# Altium schematic sheet Deel_5_display.SchDoc: Soldeerstation
size A4; DrawnBy: Kenneth Rennen; Revision: 1.0; SheetNumber: 5; SheetTotal: 5; Number: PXL_1EAI_12102667; Sheet of: 5/5
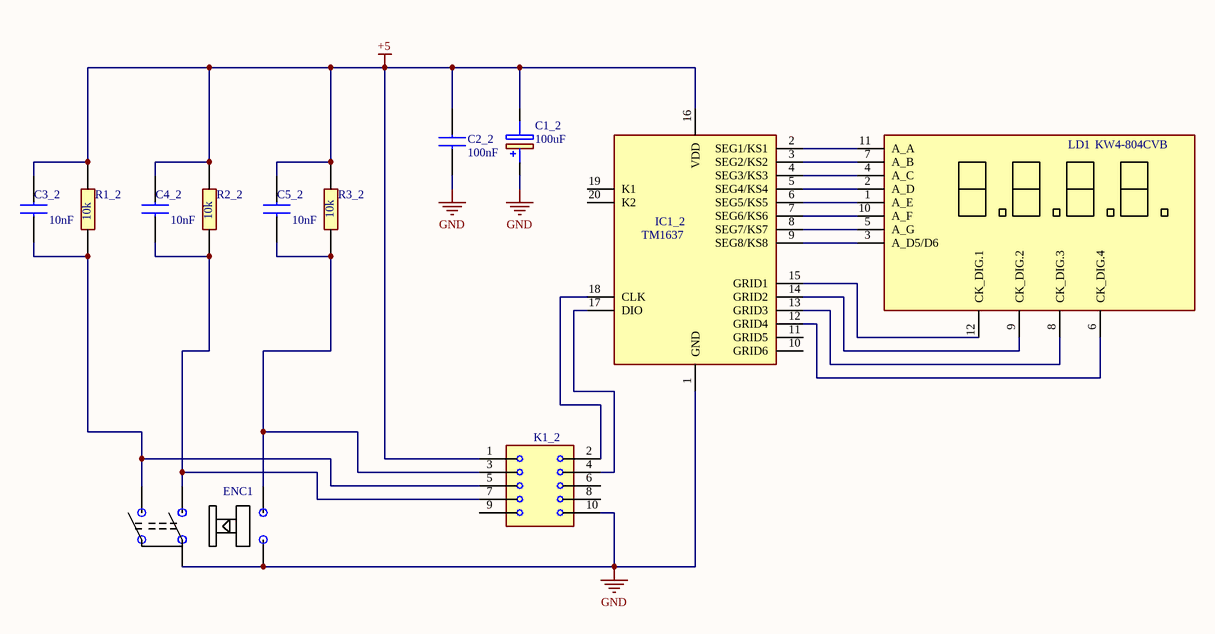
[diagram p0: Deel_5_display.SchDoc]

## Parts
C1_2  100uF  [100uf]
C2_2  100nF  [100nF]
C3_2  10nF  [10nF]
C4_2  10nF  [10nF]
C5_2  10nF  [10nF]
ENC1  PEC11R-4225F-S0024 encoder  [PEC11R-4225F-S0024]  (value not drawn)
IC1_2  TM1637  [tm1637]
K1_2  10 boxheader  [10BoxHeader]  (value not drawn)
LD1  KW4-804CVB  [kw4]
R1_2  10k  [10k]
R2_2  10k  [10k]
R3_2  10k  [10k]

## Nets
+5: C1_2.2(-) C2_2.2 C3_2.2 C4_2.2 C5_2.2 IC1_2.16(VDD) K1_2.1 R1_2.2 R2_2.2 R3_2.2
GND: C1_2.1(+) C2_2.1 ENC1.3 ENC1.4 IC1_2.1(GND) K1_2.10
NetC3_2_1: C3_2.1 ENC1.1 K1_2.5 R1_2.1
NetC4_2_1: C4_2.1 ENC1.2 K1_2.7 R2_2.1
NetC5_2_1: C5_2.1 ENC1.5 K1_2.3 R3_2.1
NetIC1_2_2: IC1_2.2(SEG1/KS1) LD1.11(A_A)
NetIC1_2_3: IC1_2.3(SEG2/KS2) LD1.7(A_B)
NetIC1_2_4: IC1_2.4(SEG3/KS3) LD1.4(A_C)
NetIC1_2_5: IC1_2.5(SEG4/KS4) LD1.2(A_D)
NetIC1_2_6: IC1_2.6(SEG5/KS5) LD1.1(A_E)
NetIC1_2_7: IC1_2.7(SEG6/KS6) LD1.10(A_F)
NetIC1_2_8: IC1_2.8(SEG7/KS7) LD1.5(A_G)
NetIC1_2_9: IC1_2.9(SEG8/KS8) LD1.3(A_D5/D6)
NetIC1_2_12: IC1_2.12(GRID4) LD1.6(CK_DIG.4)
NetIC1_2_13: IC1_2.13(GRID3) LD1.8(CK_DIG.3)
NetIC1_2_14: IC1_2.14(GRID2) LD1.9(CK_DIG.2)
NetIC1_2_15: IC1_2.15(GRID1) LD1.12(CK_DIG.1)
NetIC1_2_17: IC1_2.17(DIO) K1_2.4
NetIC1_2_18: IC1_2.18(CLK) K1_2.2

Not connected (* = marked no-connect by the designer): IC1_2 10(GRID6) 11(GRID5) 19(K1) 20(K2); K1_2 6 8 9

## Library data of the parts
C1_2 = 100uF: Capacitor Polarised RGA101M1HBK-0811G; Manufacturer_Name: Lelon; Datasheet Link: https://www.arrow.com/en/products/rga101m1hbk-0811g/lelon-electronics; Height: 13mm; Manufacturer_Part_Number: RGA101M1HBK-0811G
C2_2 = 100nF: Capacitor; Manufacturer_Name: AVX; Manufacturer_Part_Number: 0402YC104MAT2A; Datasheet Link: http://www.mouser.com/catalog/supplier/library/pdf/AVXSurfaceMountCeramic.pdf; Height: 0.56mm; Mouser Part Number: 581-0402YC104MAT2A; Mouser Price/Stock: https://www.mouser.co.uk/ProductDetail/AVX/0402YC104MAT2A?qs=O2%2FeDh0sX9yiCaLwpXy1bw%3D%3D
C3_2 C4_2 C5_2 = 10nF: Capacitor; Manufacturer_Name: AVX; Manufacturer_Part_Number: 0402YC104MAT2A; Datasheet Link: http://www.mouser.com/catalog/supplier/library/pdf/AVXSurfaceMountCeramic.pdf; Height: 0.56mm; Mouser Part Number: 581-0402YC104MAT2A; Mouser Price/Stock: https://www.mouser.co.uk/ProductDetail/AVX/0402YC104MAT2A?qs=O2%2FeDh0sX9yiCaLwpXy1bw%3D%3D
ENC1 = PEC11R-4225F-S0024 encoder: draai encoder met drukknop; Manufacturer_Name: Bourns; Datasheet Link: https://componentsearchengine.com/Datasheets/1/PEC11R-4225F-S0024.pdf; Manufacturer_Part_Number: PEC11R-4225F-S0024; Mouser Part Number: 652-PEC11R-4225F-S24; Mouser Price/Stock: https://www.mouser.co.uk/ProductDetail/Bourns/PEC11R-4225F-S0024?qs=Zq5ylnUbLm4N6UNkPX3pkQ%3D%3D; Arrow Part Number: PEC11R-4225F-S0024; Arrow Price/Stock: https://www.arrow.com/en/products/pec11r-4225f-s0024/bourns?region=nac
IC1_2 = TM1637__SOP_: Integrated Circuit; Manufacturer_Name: TITAN MICRO ELECTRONICS; Manufacturer_Part_Number: TM1637 (SOP); Datasheet Link: https://www.mcielectronics.cl/website_MCI/static/documents/Datasheet_TM1637.pdf; Height: 2.8mm
K1_2 = 10 boxheader: Connector; Manufacturer_Name: Molex; Manufacturer_Part_Number: 0010897100; Datasheet Link: http://www.molex.com/pdm_docs/sd/010897100_sd.pdf; Height: 8.64mm; Mouser Part Number: N/A; Mouser Price/Stock: https://www.mouser.co.uk/ProductDetail/Molex/0010897100?qs=PBcRNPEHKsqIDCZzUxhahw%3D%3D; Arrow Part Number: 0010897100; Arrow Price/Stock: https://www.arrow.com/en/products/0010897100/molex?region=nac
LD1 = KW4-804CVB: Display; Manufacturer_Name: Luckylight; Datasheet Link: https://www.tme.eu/Document/21b6c1f82a45ad996bb1bfe0c31af292/KW4-804XVB.pdf; Height: 7.75mm; Manufacturer_Part_Number: KW4-804CVB
R1_2 R2_2 R3_2 = 10k: Resistor; Manufacturer_Name: TE Connectivity; Manufacturer_Part_Number: CPF0805B100RE1; Datasheet Link: https://datasheet.datasheetarchive.com/originals/distributors/DKDS-21/401696.pdf; Height: 0.65mm; Mouser Part Number: 279-CPF0805B100RE1; Mouser Price/Stock: https://www.mouser.co.uk/ProductDetail/TE-Connectivity-Holsworthy/CPF0805B100RE1?qs=9ylKvqdyudkCWLPT1QvLZQ%3D%3D; Arrow Part Number: CPF0805B100RE1; Arrow Price/Stock: https://www.arrow.com/en/products/cpf0805b100re1/te-connectivity?region=nac